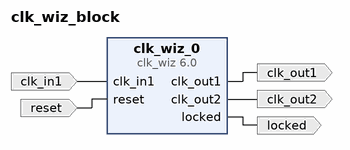
[diagram p0: block diagram of the top level]
# Vivado block design clk_wiz_block, xc7s50csga324-1, Vivado 2022.2
create_bd_design clk_wiz_block

create_bd_port -dir I -type clk clk_in1
set_property -dict {CONFIG.FREQ_HZ 100000000} [get_bd_ports clk_in1]
create_bd_port -dir I -type rst reset
set_property -dict {CONFIG.POLARITY ACTIVE_HIGH} [get_bd_ports reset]
create_bd_port -dir O -type clk clk_out1
create_bd_port -dir O locked
create_bd_port -dir O -type clk clk_out2

create_bd_cell -type ip -vlnv xilinx.com:ip:clk_wiz:6.0 clk_wiz_0
set_property -dict [list \
  CONFIG.CLKOUT1_JITTER 175.402 \
  CONFIG.CLKOUT1_REQUESTED_OUT_FREQ 25 \
  CONFIG.CLKOUT2_JITTER 125.247 \
  CONFIG.CLKOUT2_PHASE_ERROR 98.575 \
  CONFIG.CLKOUT2_REQUESTED_OUT_FREQ 125 \
  CONFIG.CLKOUT2_USED true \
  CONFIG.MMCM_CLKOUT0_DIVIDE_F 40.000 \
  CONFIG.MMCM_CLKOUT1_DIVIDE 8 \
  CONFIG.NUM_OUT_CLKS 2 \
] [get_bd_cells clk_wiz_0]

# ---- connections ----

connect_bd_net -net clk_100MHz_1 [get_bd_ports clk_in1] [get_bd_pins clk_wiz_0/clk_in1]
connect_bd_net [get_bd_pins clk_wiz_0/clk_out1] [get_bd_ports clk_out1]
connect_bd_net [get_bd_pins clk_wiz_0/clk_out2] [get_bd_ports clk_out2]
connect_bd_net [get_bd_pins clk_wiz_0/locked] [get_bd_ports locked]
connect_bd_net -net reset_rtl_0_1 [get_bd_ports reset] [get_bd_pins clk_wiz_0/reset]

validate_bd_design
save_bd_design
